# EAGLE design 130910_IMU_AriloRX_0_0 (EAGLE 6.4)
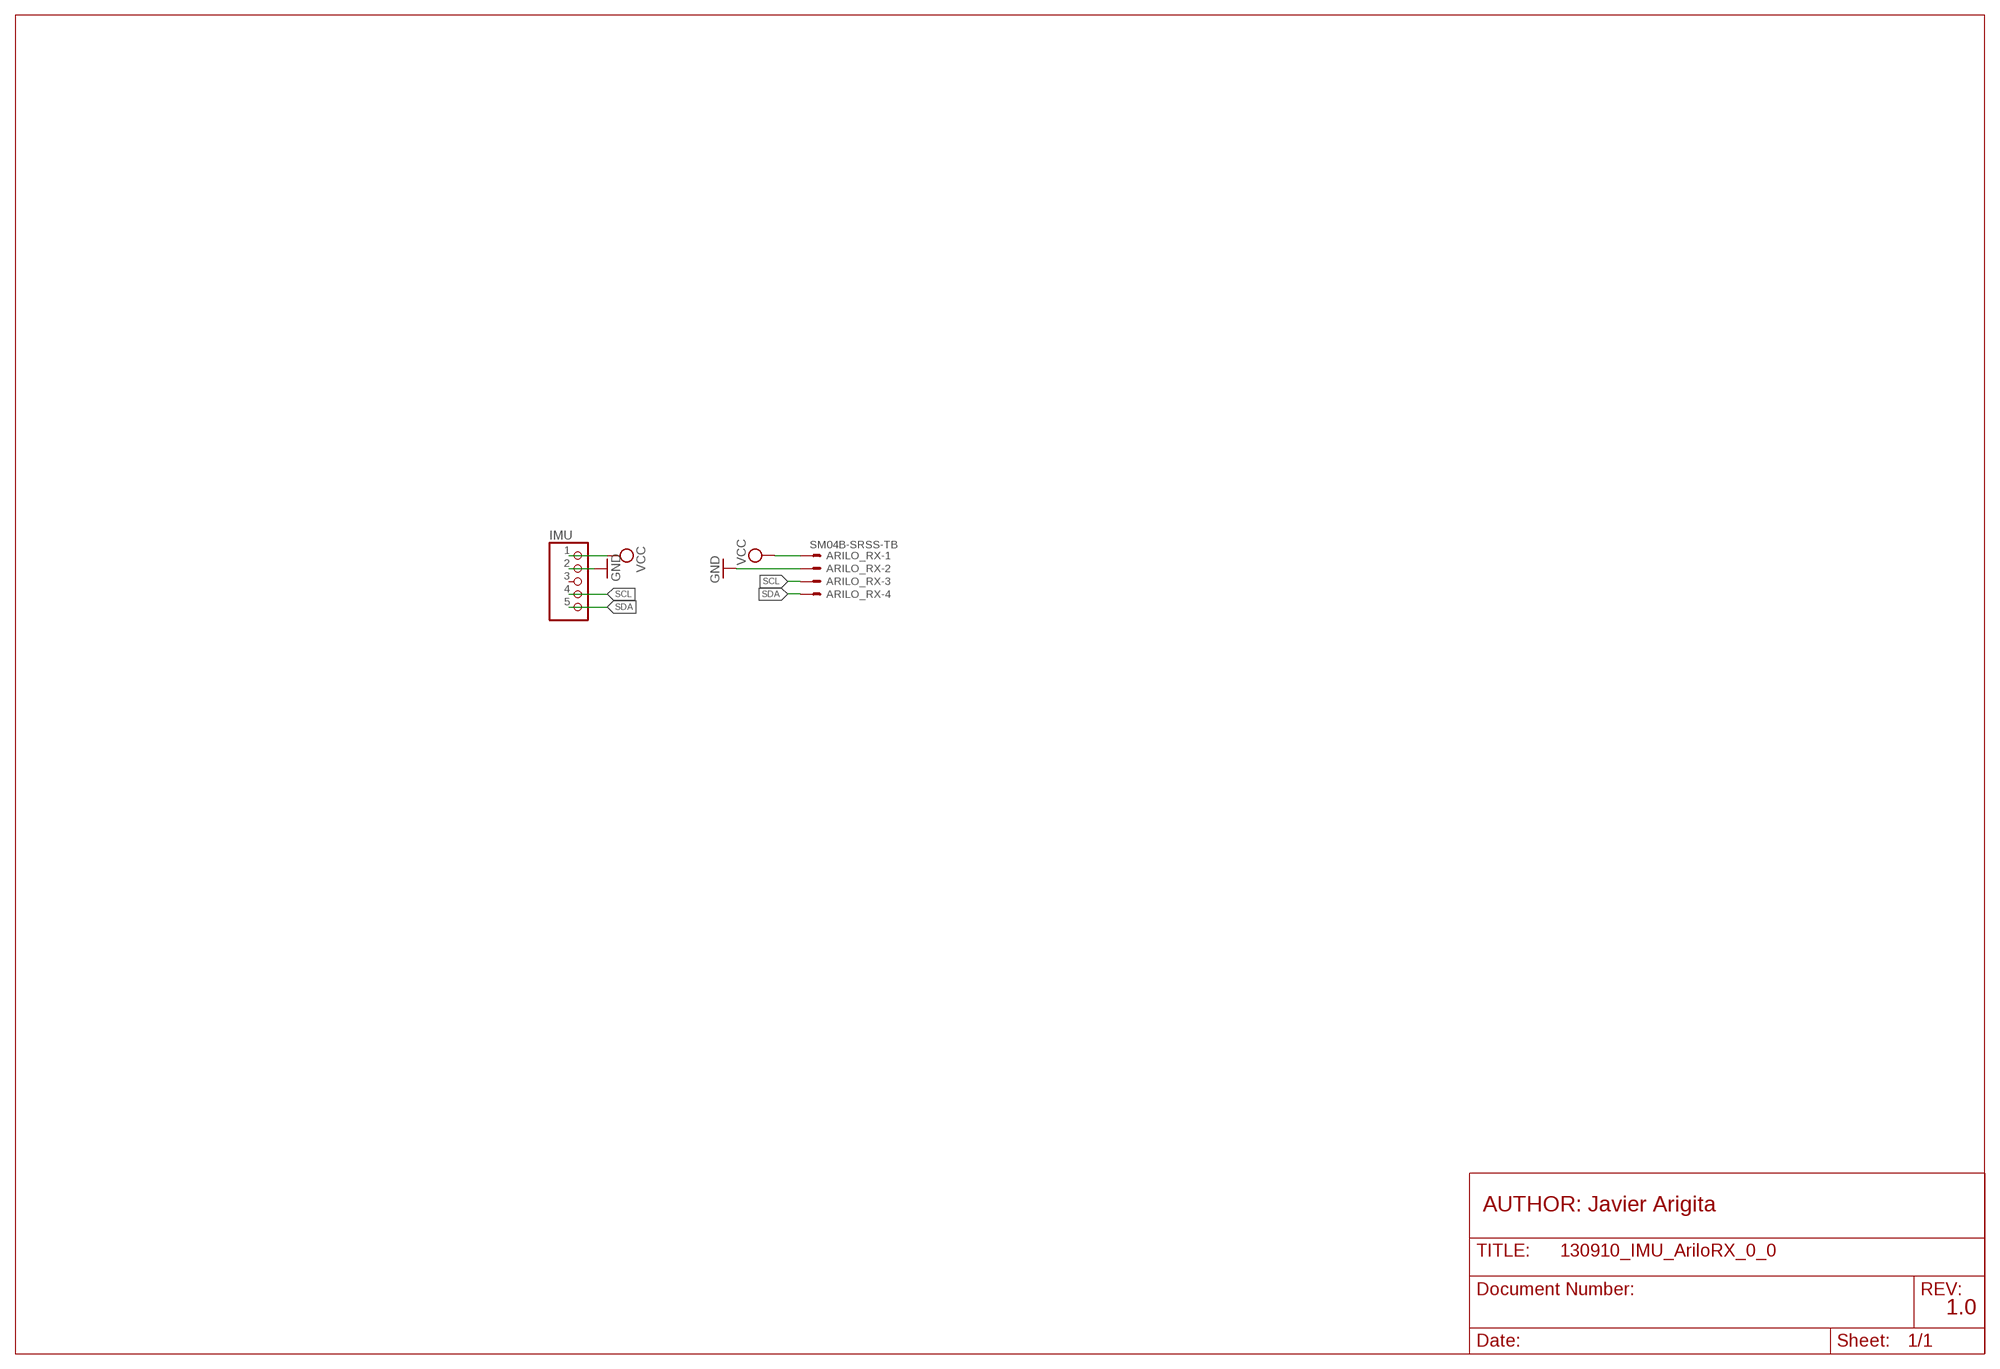
[diagram p0: schematic, sheet 1]

## Parts
ARILO_RX  SM04B-SRSS-TB  [SM04B-SRSS-TB]
IMU  PINHD-1X5  [1X05]

## Nets
GND: ARILO_RX.2 IMU.2
SCL: ARILO_RX.3 IMU.4
SDA: ARILO_RX.4 IMU.5
VCC: ARILO_RX.1 IMU.1
Unconnected: IMU.3

## Notes on the sheet
- AUTHOR: Javier Arigita
- 1.0

## Library data of the parts
ARILO_RX = con-jst2:?M04B-SRSS-TB: Disconnectable Crimp style connector, 1.0mm pitch 4 contacts
IMU = pinhead:PINHD-1X5: PIN HEADER

## Board
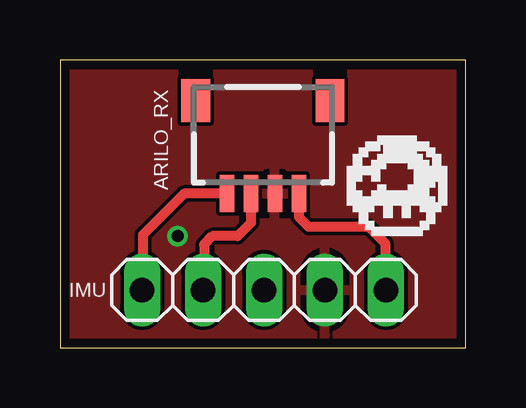
[diagram p1: board, top side]
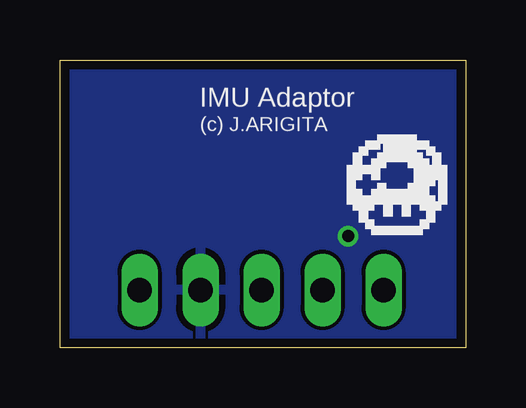
[diagram p2: board, bottom side, seen from below]

Size 16.9 x 12 mm. Coordinates in mm from the lower left corner, seen from the top.
Outline: 0,0 16.9,0 16.9,12 0,12 0,0
Copper layers (1*16): Top 0.0356mm / dielectric 1.5011mm / Bottom 0.0356mm
Design rules "LaenPCBOrder": minimum track width 6mil, minimum drill 13mil, track to track 6mil, track to pad 6mil, pad to pad 6mil, via to via 6mil, smd to smd 6mil, copper to edge 15mil, drill to drill 6mil, minimum pad ring 7mil, minimum via ring 7mil, stop-mask expansion 4mil, vias tented up to drill 0mil, thermal gap 10mil

### Footprints (pad centres in the part's own frame; a part is rotated, then mirrored left to right if it is on the bottom)
SM04B-SRSS-TB = smd 0.6 x 1.55: 1 -1.5,2.975; 2 -0.5,2.975; 3 0.5,2.975; 4 1.5,2.975 | smd 1.2 x 1.8: FIT@1 -2.8,-0.9; FIT@2 2.8,-0.9
1X05 = drill 1.016 long: 1 -5.08,0; 2 -2.54,0; 3 0,0; 4 2.54,0; 5 5.08,0

### Placement (x,y rotation side)
ARILO_RX  8.45,9.4 180 top
IMU  8.5,2.4 180 top

### Tracks (layer width: path | path; a pad name or v marks a point on that pad's centre or on a via)
GND  (via drill 0.5)
  other vias: 4.9,4.65
  pour Top: 16.7,0.2 0.2,0.2 0.2,11.8 16.7,11.8
  pour Bottom: 16.7,0.2 0.2,0.2 0.2,11.8 16.7,11.8
SCL
  Top 0.406: ARILO_RX.3 7.95,5.2 7.4,4.65 6.35,4.65 6,4.3 6,2.44 IMU.4
SDA
  Top 0.406: ARILO_RX.4 5.17,6.42 3.45,4.7 3.45,2.43 IMU.5
VCC
  Top 0.406: ARILO_RX.1 9.95,5.45 10.35,5.05 12.85,5.05 13.55,4.35 13.55,2.43 IMU.1

### Text on the board
bNames: IMU Adaptor | (c) J.ARIGITA